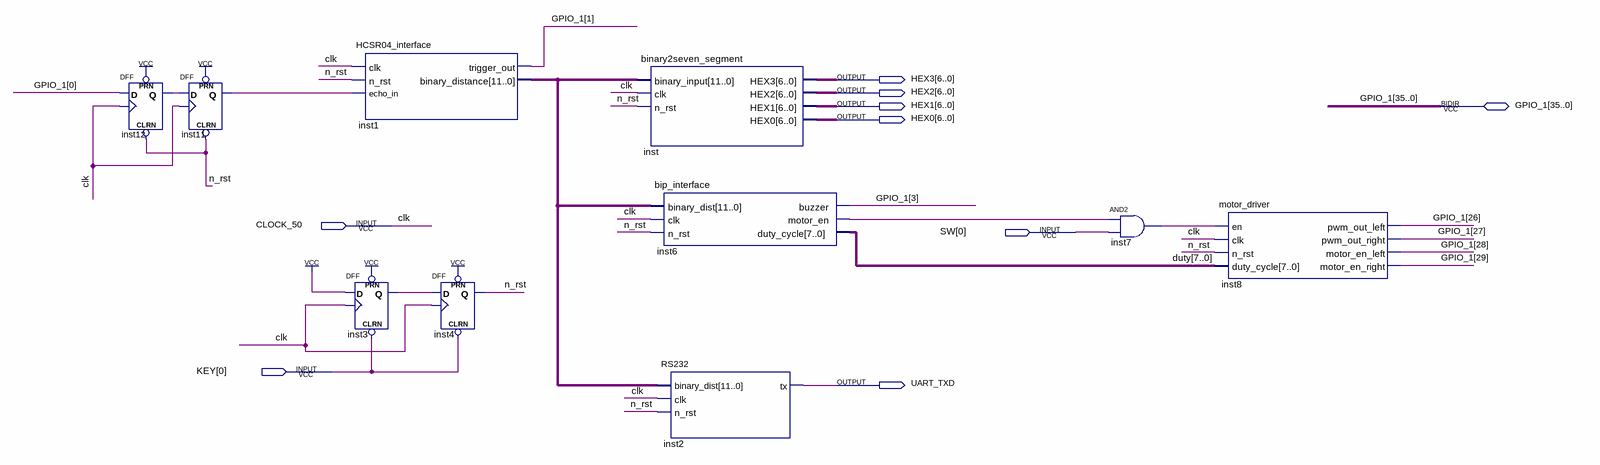
[diagram p0: schematic sheet]
// Quartus schematic progetto.bdf as structural Verilog: 10 symbols, 9 pins
module progetto (
  input  CLOCK_50,
  input  [0:0] SW,
  input  [0:0] KEY,
  inout  [35:0] GPIO_1,
  output [6:0] HEX3,
  output [6:0] HEX2,
  output [6:0] HEX1,
  output [6:0] HEX0,
  output UART_TXD
);

  wire inst3_q, inst6_motor_en, inst7_out, inst11_q, inst12_q, n_rst;
  wire [7:0] duty;
  wire [11:0] inst1_binary_distance;

  DFF inst12 (.CLRN(n_rst), .CLK(CLOCK_50), .D(GPIO_1[0]), .PRN(1'b1), .Q(inst12_q));
  DFF inst11 (.CLRN(n_rst), .CLK(CLOCK_50), .D(inst12_q), .PRN(1'b1), .Q(inst11_q));
  DFF inst3 (.CLRN(KEY[0]), .CLK(CLOCK_50), .D(1'b1), .PRN(1'b1), .Q(inst3_q));
  HCSR04_interface inst1 (
    .clk(CLOCK_50), .n_rst(n_rst), .echo_in(inst11_q), .trigger_out(GPIO_1[1]),
    .binary_distance(inst1_binary_distance));
  DFF inst4 (.CLRN(KEY[0]), .CLK(CLOCK_50), .D(inst3_q), .PRN(1'b1), .Q(n_rst));
  binary2seven_segment inst (
    .binary_input(inst1_binary_distance), .clk(CLOCK_50), .n_rst(n_rst), .HEX3(HEX3), .HEX2(HEX2),
    .HEX1(HEX1), .HEX0(HEX0));
  bip_interface inst6 (
    .binary_dist(inst1_binary_distance), .clk(CLOCK_50), .n_rst(n_rst), .buzzer(GPIO_1[3]),
    .motor_en(inst6_motor_en), .duty_cycle(duty));
  RS232 inst2 (.binary_dist(inst1_binary_distance), .clk(CLOCK_50), .n_rst(n_rst), .tx(UART_TXD));
  and inst7 (inst7_out, inst6_motor_en, SW[0]);
  motor_driver inst8 (
    .en(inst7_out), .clk(CLOCK_50), .n_rst(n_rst), .duty_cycle(duty), .pwm_out_left(GPIO_1[26]),
    .pwm_out_right(GPIO_1[27]), .motor_en_left(GPIO_1[28]), .motor_en_right(GPIO_1[29]));

  // Other names for the same wires on the sheet: clk = CLOCK_50
endmodule
